# EAGLE design GPSReceiver_Kenwood710 (EAGLE 6.5.0)
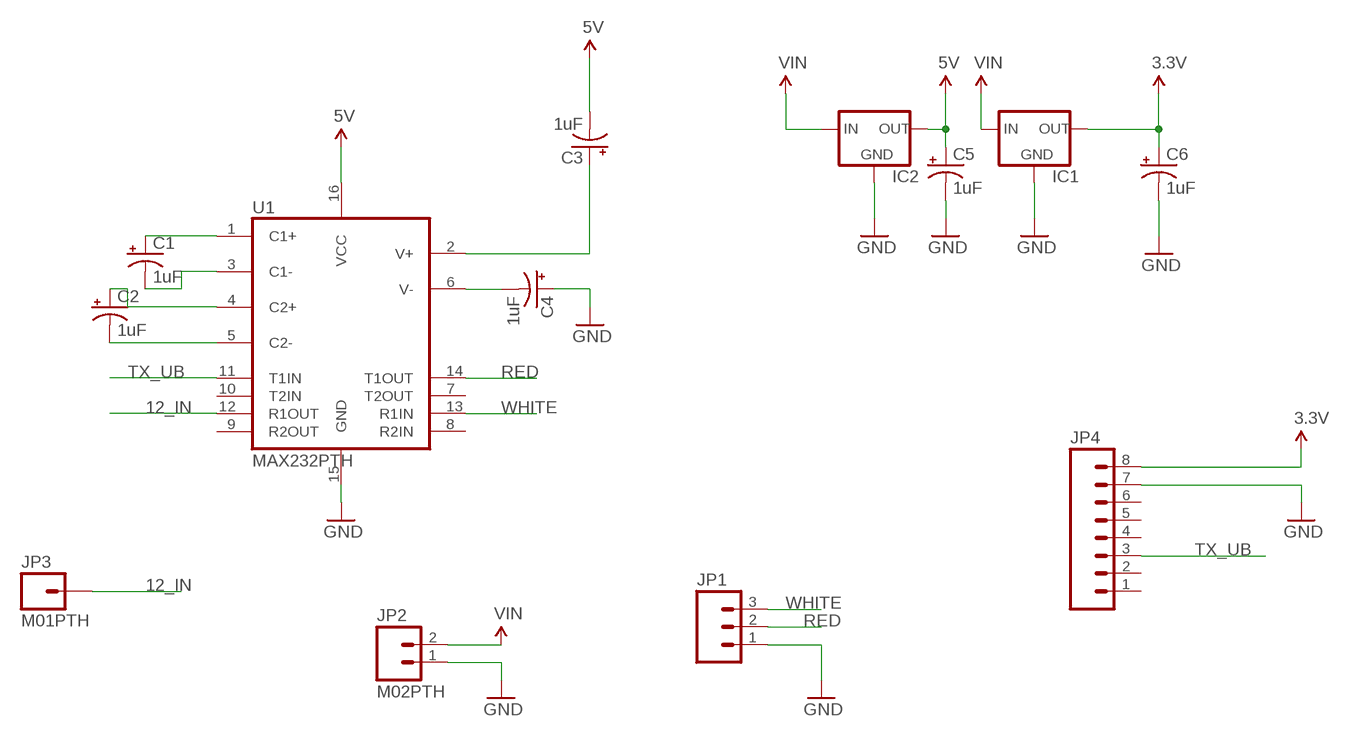
[diagram p0: schematic, sheet 1]

## Parts
C1  1uF  CAP_POLPTH2  [CPOL-RADIAL-10UF-25V]
C2  1uF  CAP_POLPTH2  [CPOL-RADIAL-10UF-25V]
C3  1uF  CAP_POLPTH2  [CPOL-RADIAL-10UF-25V]
C4  1uF  CAP_POLPTH2  [CPOL-RADIAL-10UF-25V]
C5  1uF  CAP_POLPTH2  [CPOL-RADIAL-10UF-25V]
C6  1uF  CAP_POLPTH2  [CPOL-RADIAL-10UF-25V]
IC1  V_REG_78XX-TO-220  [TO-220-ALT]
IC2  V_REG_78XX-TO-220  [TO-220-ALT]
JP1  M03PTH  [1X03]
JP2  M02PTH  [1X02]
JP3  M01PTH  [1X01]
JP4  M08LOCK  [1X08_LOCK]
U1  MAX232PTH  [DIL16]

## Nets
3.3V: C6.1(+) IC1.OUT JP4.8
5V: C3.2(-) C5.1(+) IC2.OUT U1.16(VCC)
12_IN: JP3.1 U1.12(R1OUT)
GND: C4.1(+) C5.2(-) C6.2(-) IC1.GND IC2.GND JP1.1 JP2.1 JP4.7 U1.15(GND)
N$1: C1.1(+) U1.1(C1+)
N$2: C1.2(-) U1.3(C1-)
N$3: C2.1(+) U1.4(C2+)
N$4: C2.2(-) U1.5(C2-)
N$5: C3.1(+) U1.2(V+)
N$6: C4.2(-) U1.6(V-)
RED: JP1.2 U1.14(T1OUT)
TX_UB: JP4.3 U1.11(T1IN)
VIN: IC1.IN IC2.IN JP2.2
WHITE: JP1.3 U1.13(R1IN)
Unconnected: JP4.1 JP4.2 JP4.4 JP4.5 JP4.6 U1.7(T2OUT) U1.8(R2IN) U1.9(R2OUT) U1.10(T2IN)

## Library data of the parts
C1-C6 = SparkFun-Passives:CAP_POL: Capacitor Polarized These are standard SMD and PTH capacitors. Normally 10uF, 47uF, and 100uF in electrolytic and tantalum varieties. Always verify the external diameter of the through hole cap, it varies with capacity, voltage, and manufacturer. The EIA devices should be standard.
IC1 IC2 = SparkFun-PowerIC:V_REG_78XX: Voltage Regulator Standard 7805 5V regulator. IGO (Input Ground Output). Spark Fun Electronics SKU : COM-00107
JP1 = SparkFun-Connectors:M03: Header 3 Standard 3-pin 0.1" header. Use with straight break away headers (SKU : PRT-00116), right angle break away headers (PRT-00553), swiss pins (PRT-00743), machine pins (PRT-00117), and female headers (PRT-00115). Molex polarized connector foot print use with SKU : PRT-08232 with associated crimp pins and housings.
JP2 = SparkFun-Connectors:M02: Standard 2-pin 0.1" header. Use with - straight break away headers ( PRT-00116) - right angle break away headers (PRT-00553) - swiss pins (PRT-00743) - machine pins (PRT-00117) - female headers (PRT-00115) Molex polarized connector foot print use with: PRT-08233 with associated crimp pins and housings. 2.54_SCREWTERM for use with PRT-10571. 3.5mm Screw Terminal footprints for PRT-08084 5mm Screw Terminal footprints for use with PRT-08433
JP3 = SparkFun-Connectors:M01: Header 1 Standard 1-pin 0.1" header. Use with straight break away headers (SKU : PRT-00116), right angle break away headers (PRT-00553), swiss pins (PRT-00743), machine pins (PRT-00117), and female headers (PRT-00115).
JP4 = SparkFun-Connectors:M08: Header 8 Standard 8-pin 0.1" header. Use with straight break away headers (SKU : PRT-00116), right angle break away headers (PRT-00553), swiss pins (PRT-00743), machine pins (PRT-00117), and female headers (PRT-00115).
U1 = SparkFun-DigitalIC:MAX232: RS232 Transceiver Very common IC. This is generically called 'MAX232', but works with the 3V equivalent MAX3232 generic ICs. Field tested and mother approved. Spark Fun Electronics SKU : COM-00316 (DIP) and COM-00589 (SMD)

## Net classes
0 default: width 0.305 mm, drill 0.3 mm, clearance 0.305 mm

## Board
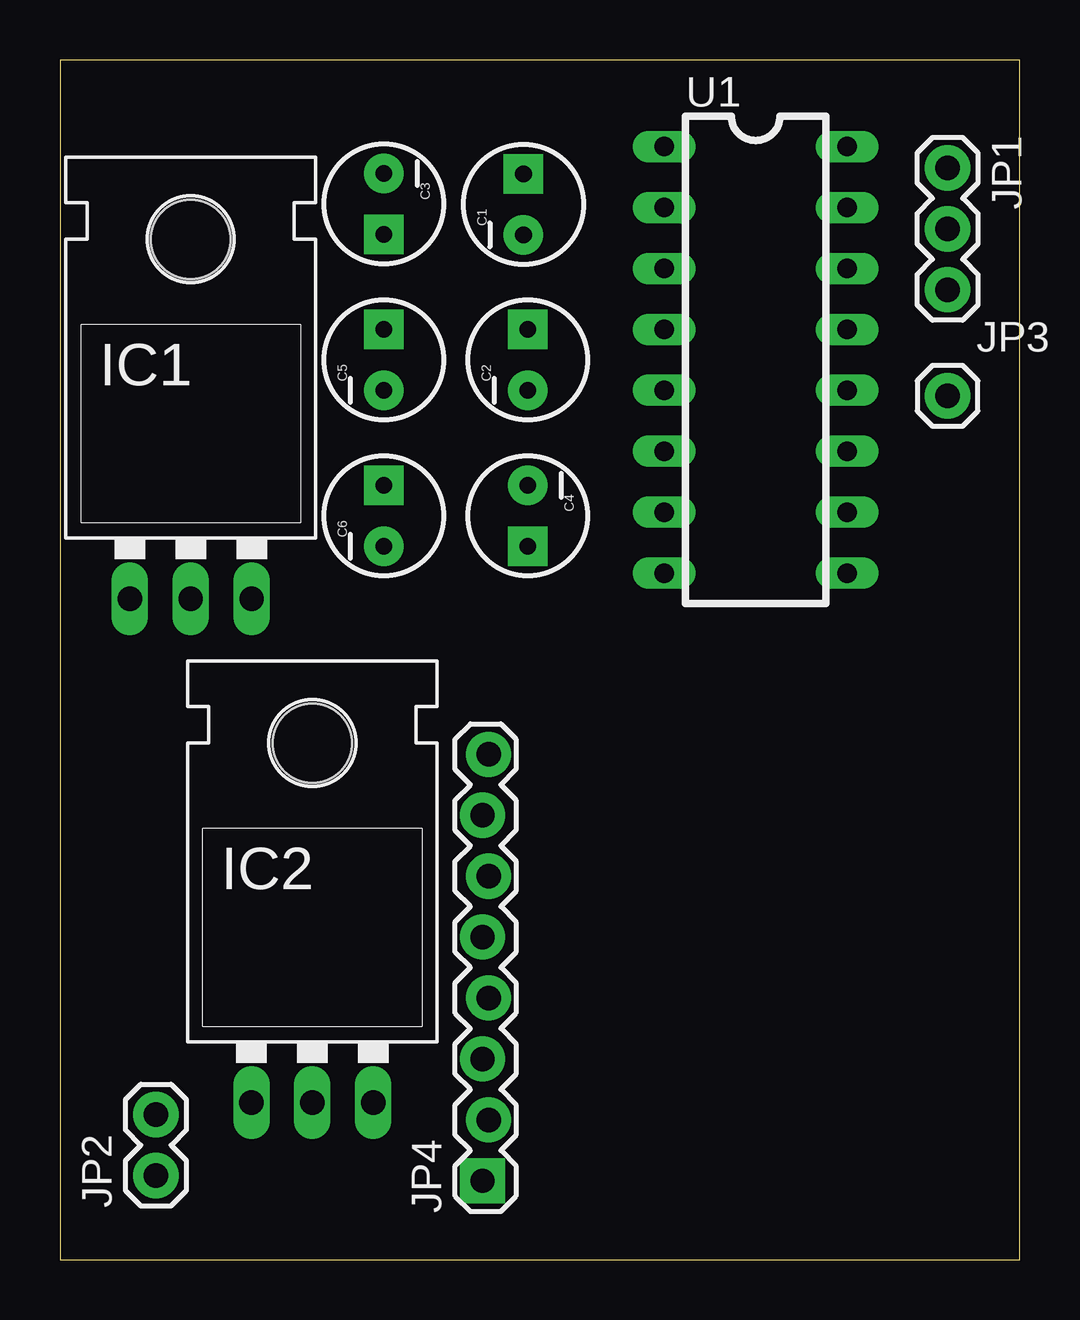
[diagram p1: board, top side]
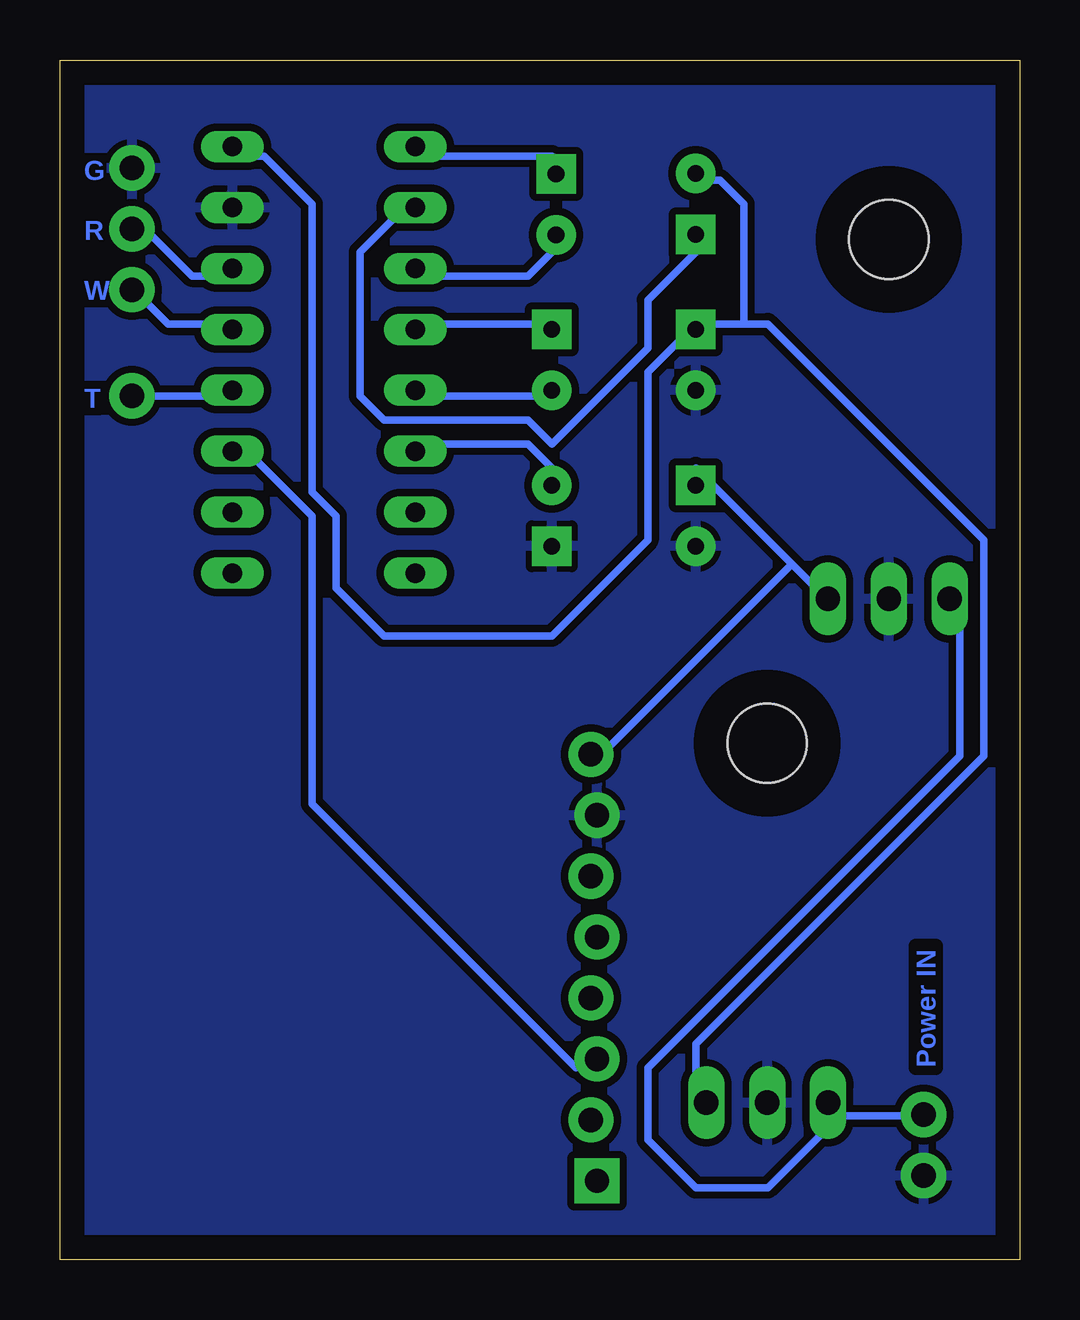
[diagram p2: board, bottom side, seen from below]

Size 40 x 50 mm. Coordinates in mm from the lower left corner, seen from the top.
Outline: 0,0 40,0 40,50 0,50 0,0
Copper layers (1*16): Top 0.035mm / dielectric 1.5mm / Bottom 0.035mm
Design rules "default": minimum track width 10mil, minimum drill 24mil, track to track 8mil, track to pad 8mil, pad to pad 8mil, via to via 8mil, smd to smd 8mil, copper to edge 40mil, drill to drill 8mil, minimum pad ring 10mil, minimum via ring 8mil, stop-mask expansion 4mil, vias tented up to drill 0mil, thermal gap 10mil

### Footprints (pad centres in the part's own frame; a part is rotated, then mirrored left to right if it is on the bottom)
CPOL-RADIAL-10UF-25V = drill 0.7 pad 1.651 square: 1 1.27,0 | drill 0.7 pad 1.651: 2 -1.27,0
TO-220-ALT = drill 1.016 long: GND 0,-3.81; IN -2.54,-3.81; OUT 2.54,-3.81 | hole 3.302: 0,11.176
1X03 = drill 1.016 pad 1.88: 1 0,0; 2 2.54,0; 3 5.08,0
1X02 = drill 1.016 pad 1.88: 1 0,0; 2 2.54,0
1X01 = drill 1.016 pad 1.88: 1 0,0
1X08_LOCK = drill 1.016 pad 1.88 square: 1 0,0.127 | drill 1.016 pad 1.88: 2 2.54,-0.127; 3 5.08,0.127; 4 7.62,-0.127; 5 10.16,0.127; 6 12.7,-0.127; 7 15.24,0.127; 8 17.78,-0.127
DIL16 = drill 0.813 long: 1 -8.89,-3.81; 2 -6.35,-3.81; 3 -3.81,-3.81; 4 -1.27,-3.81; 5 1.27,-3.81; 6 3.81,-3.81; 7 6.35,-3.81; 8 8.89,-3.81; 9 8.89,3.81; 10 6.35,3.81; 11 3.81,3.81; 12 1.27,3.81; 13 -1.27,3.81; 14 -3.81,3.81; 15 -6.35,3.81; 16 -8.89,3.81

### Placement (x,y rotation side)
C1  19.32,43.98 90 top
C2  19.5,37.5 90 top
C3  13.5,44 270 top
C4  19.5,31 270 top
C5  13.5,37.5 90 top
C6  13.5,31 90 top
IC1  5.45,31.35 0 top
IC2  10.52,10.35 0 top
JP1  37,45.5 270 top
JP2  4,3.5 90 top
JP3  37,36 0 top
JP4  17.74,3.28 90 top
U1  29,37.5 270 top

### Tracks (layer width: path | path; a pad name or v marks a point on that pad's centre or on a via)
3.3V
  Bottom 0.305: 9.5,29 13.5,33 C6.1 | 9.5,29 17.5,21 JP4.8 | 9.5,29 8.04,27.54 IC1.OUT
5V
  Bottom 0.305: 13.5,39 15.5,37 15.5,30 19.5,26 26.5,26 28.5,28 28.5,31 29.5,32 29.5,44 31.5,46 32.5,46 U1.16 | 13.5,39 11.5,39 | 11.5,39 10.5,39 1.5,30 1.5,21 13.5,9 13.5,7 IC2.OUT | 13.5,39 C5.1 | 11.5,39 11.5,44 12.5,45 13.5,45 C3.2
12_IN
  Bottom 0.305: JP3.1 33.5,36 U1.12
GND
  pour Bottom: 0,50 40,50 40,0 0,0
N$1
  Bottom 0.305: U1.1 24.5,46 19.5,46 C1.1
N$2
  Bottom 0.305: U1.3 24.5,41 20.5,41 19.5,42 C1.2
N$3
  Bottom 0.305: U1.4 24.5,39 19.5,39 C2.1
N$4
  Bottom 0.305: U1.5 24.5,36 19.5,36 C2.2
N$5
  Bottom 0.305: U1.2 25.5,44 27.5,42 27.5,36 26.5,35 20.5,35 19.5,34 15.5,38 15.5,40 13.5,42 C3.1
N$6
  Bottom 0.305: U1.6 24.5,34 20.5,34 19.5,33 C4.2
RED
  Bottom 0.305: U1.14 33.5,41 34.5,41 36.5,43 JP1.2
TX_UB
  Bottom 0.305: U1.11 32.5,34 29.5,31 29.5,19 18.5,8 JP4.3
VIN
  Bottom 0.305: 7.5,6 10.5,3 13.5,3 15.5,5 15.5,8 2.5,21 2.5,27 IC1.IN | 7.5,6 4.5,6 JP2.2 | 7.5,6 IC2.IN
WHITE
  Bottom 0.305: U1.13 33.5,39 35.5,39 36.5,40 JP1.3

### Text on the board
Bottom: G | R | W | T | Power IN